# EAGLE design RS232- EIB_Router V1.0 (EAGLE 5.10)
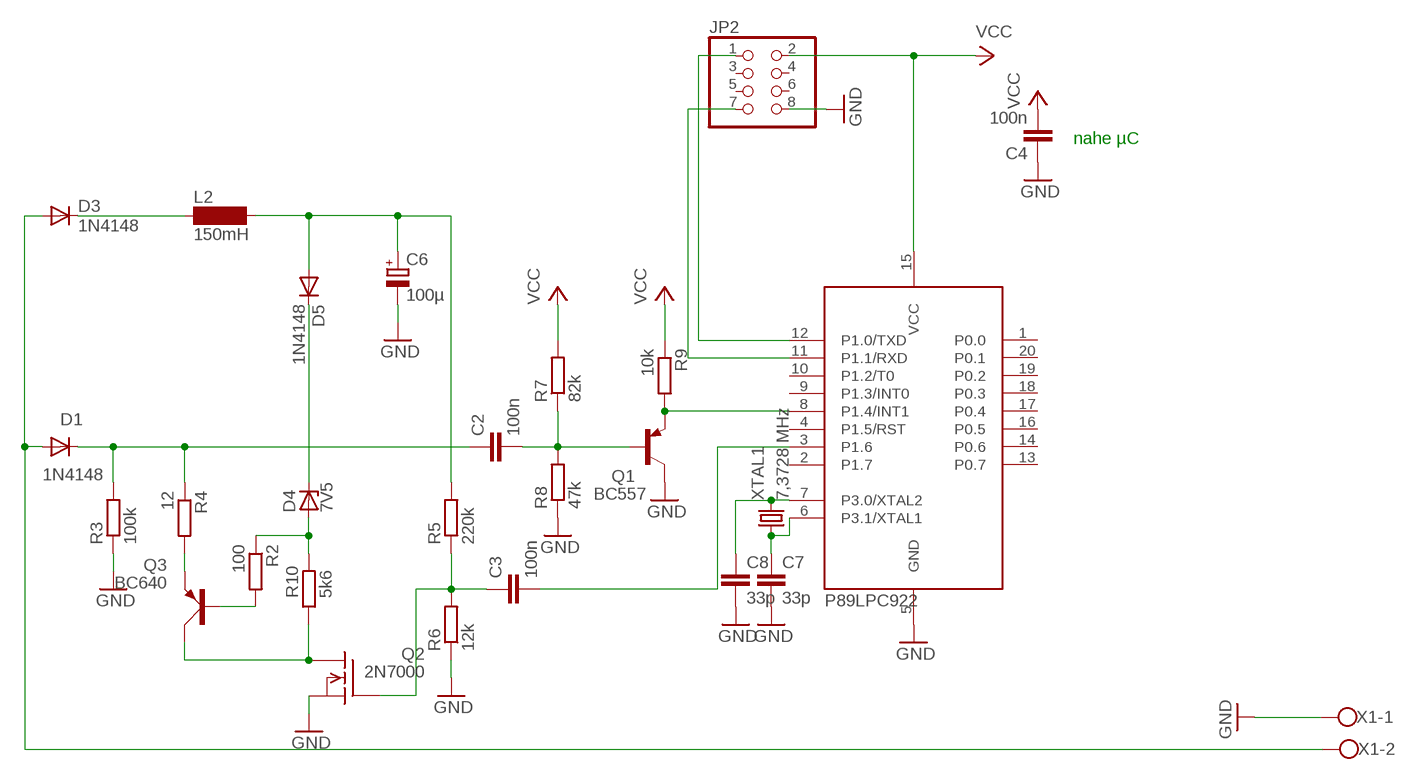
[diagram p0: schematic, sheet 1]

## Parts
C2  100n  C-EU050-024X044  [C050-024X044]
C3  100n  C-EU050-024X044  [C050-024X044]
C4  100n  C-EU050-024X044  [C050-024X044]
C6  100µ  CPOL-EUE5-8.5  [E5-8,5]
C7  33p  C-EU025-024X044  [C025-024X044]
C8  33p  C-EU025-024X044  [C025-024X044]
D1  1N4148  1N4148DO35-7  [DO35-7]
D3  1N4148  1N4148DO35-7  [DO35-7]
D4  7V5  ZPD  [DO35Z10]
D5  1N4148  1N4148DO35-7  [DO35-7]
JP2  PINHD-2X4  [2X04]
L2  150mH  SD12-1000  [SD12_1000]
Q1  BC557  [TO92]
Q2  2N7000  VN2222KM  [TO237]
Q3  BC640  [SOT54D]
R2  100  R-EU_0207/10  [0207/10]
R3  100k  R-EU_0207/10  [0207/10]
R4  12  R-EU_0207/10  [0207/10]
R5  220k  R-EU_0207/10  [0207/10]
R6  12k  R-EU_0207/10  [0207/10]
R7  82k  R-EU_0207/10  [0207/10]
R8  47k  R-EU_0207/10  [0207/10]
R9  10k  R-EU_0207/10  [0207/10]
R10  5k6  R-EU_0207/10  [0207/10]
U1  89LPC922  [DIL20]
X1  W237-102  [W237-102]
XTAL1  7,3728 MHz  CRYSTALHC49S  [HC49/S]

## Nets
GND: C4.1 C6.- C7.2 C8.2 JP2.8 Q1.3(C) Q2.3(S) R3.1 R6.1 R8.1 U1.5(GND) X1.1
N$1: Q1.1(E) R9.2 U1.8(P1.4/INT1)
N$2: C2.2 Q1.2(B) R7.1 R8.2
N$3: C6.+ D5.A L2.2 R5.2
N$5: C3.2 U1.3(P1.6)
N$6: Q2.1(D) Q3.C R10.1
N$8: D3.C L2.1
N$9: C2.1 D1.C R3.2 R4.1
N$11: D4.A R2.1 R10.2
N$12: Q3.E R4.2
N$14: Q3.B R2.2
N$16: D1.A D3.A X1.2
N$20: C8.1 U1.7(P3.0/XTAL2) XTAL1.2
N$21: C7.1 U1.6(P3.1/XTAL1) XTAL1.1
N$29: JP2.1 U1.12(P1.0/TXD)
N$30: JP2.7 U1.11(P1.1/RXD)
N$34: C3.1 Q2.2(G) R5.1 R6.2
N$40: D4.C D5.C
VCC: C4.2 JP2.2 R7.2 R9.1 U1.15(VCC)
Unconnected: JP2.3 JP2.4 JP2.5 JP2.6 U1.1(P0.0) U1.2(P1.7) U1.4(P1.5/RST) U1.9(P1.3/INT0) U1.10(P1.2/T0) U1.13(P0.7) U1.14(P0.6) U1.16(P0.5) U1.17(P0.4) U1.18(P0.3) U1.19(P0.2) U1.20(P0.1)

## Notes on the sheet
- nahe µC
- P89LPC922

## Library data of the parts
C2-C4 C7 C8 = rcl:C-EU: CAPACITOR, European symbol
C6 = rcl:CPOL-EU: POLARIZED CAPACITOR, European symbol
D1 D3 D5 = diode:1N4148: DIODE high speed (Philips)
D4 = diode:ZPD: Z DIODE 500 mW
JP2 = pinhead:PINHD-2X4: PIN HEADER
L2 = inductor-neosid:SD12: INDUCTOR nominal inductance
Q1 = transistor-pnp:BC557: PNP Transistor
Q2 = transistor-fet:VN2222KM: N-Channel Enhancement MOSFET (VMOS); 60V; 0,5A; 7,5Ohm
Q3 = transistor-small-signal:BC640: PNP TRANSISTOR
R2-R10 = rcl:R-EU_: RESISTOR, European symbol
U1 = micro-philips:89LPC922
X1 = con-wago-500:W237-102: WAGO SCREW CLAMP
XTAL1 = crystal:CRYSTAL: CRYSTAL

## Board
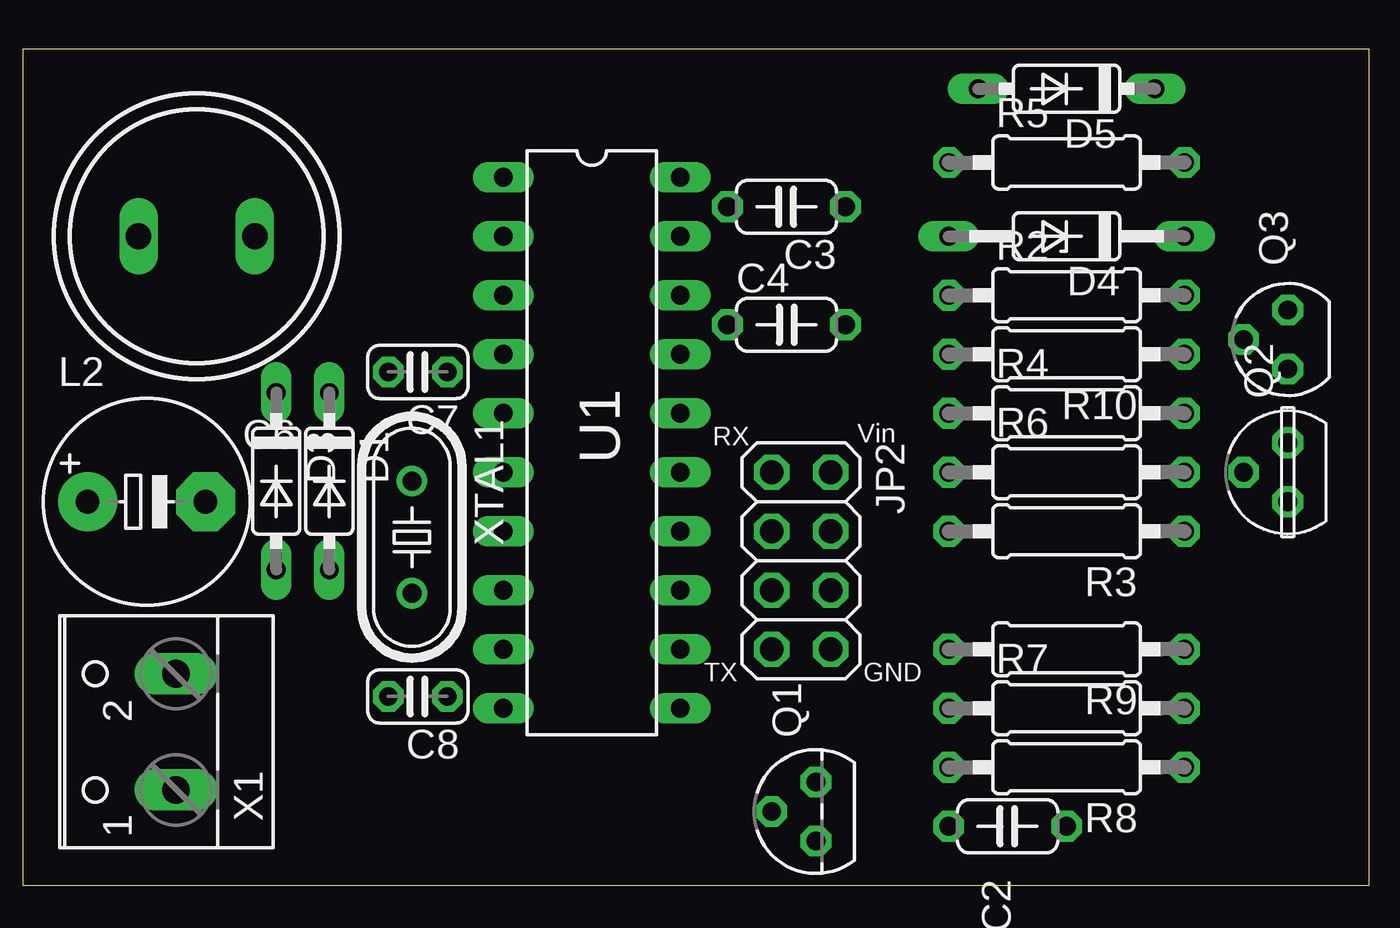
[diagram p1: board, top side]
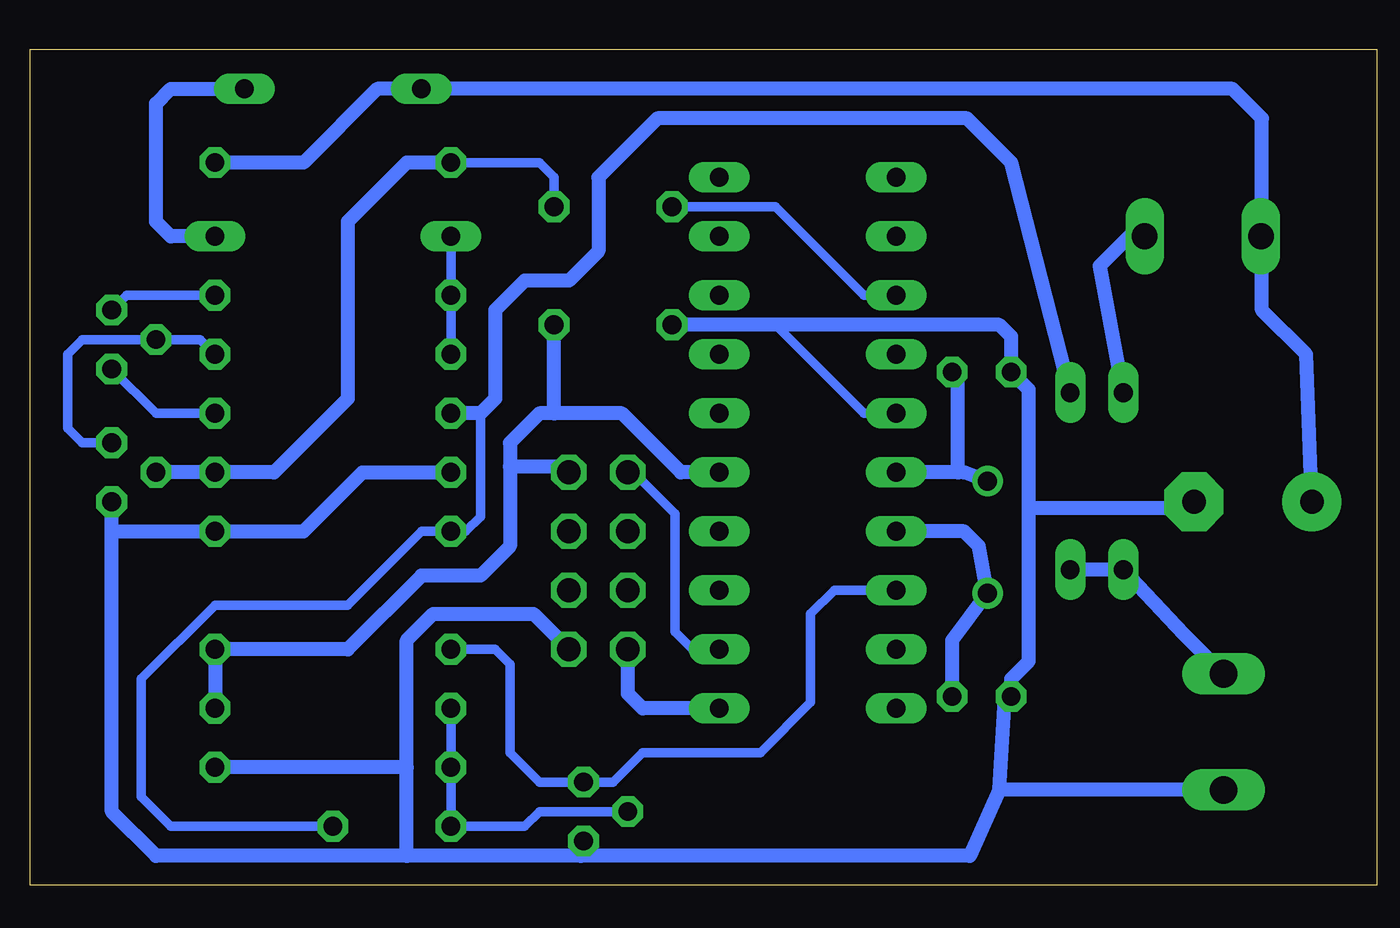
[diagram p2: board, bottom side, seen from below]

No outline drawn. Coordinates in mm, seen from the top.
Copper layers (1*16): Top 0.035mm / dielectric 1.5mm / Bottom 0.035mm
Design rules "0.3mm": minimum track width 10mil, minimum drill 24mil, track to track 0.3mm, track to pad 0.3mm, pad to pad 0.3mm, via to via 0.3mm, smd to smd 0.3mm, copper to edge 0mil, drill to drill 8mil, minimum pad ring 10mil, minimum via ring 8mil, stop-mask expansion 4mil, vias tented up to drill 0mil, thermal gap 10mil
Milling: 4 lines

### Footprints (pad centres in the part's own frame; a part is rotated, then mirrored left to right if it is on the bottom)
C050-024X044 = drill 0.813 octagon: 1 -2.54,0; 2 2.54,0
E5-8,5 = drill 1.016 pad 2.54 round: + -2.54,0 | drill 1.016 pad 2.54 octagon: - 2.54,0
C025-024X044 = drill 0.813 octagon: 1 -1.27,0; 2 1.27,0
DO35-7 = drill 0.813 long: A 3.81,0; C -3.81,0
DO35Z10 = drill 0.813 long: A 5.08,0; C -5.08,0
2X04 = drill 1.016 octagon: 1 -3.81,-1.27; 2 -3.81,1.27; 3 -1.27,-1.27; 4 -1.27,1.27; 5 1.27,-1.27; 6 1.27,1.27; 7 3.81,-1.27; 8 3.81,1.27
SD12_1000 = drill 1.1 long: 1 -2.5,0; 2 2.5,0
TO92 = drill 0.813 octagon: 1 1.27,0; 2 0,1.905; 3 -1.27,0
TO237 = drill 0.813 octagon: 1 1.27,0; 2 0,1.905; 3 -1.27,0
SOT54D = drill 0.813 octagon: B 1.27,0; C 0,1.905; E -1.27,0
0207/10 = drill 0.813 octagon: 1 -5.08,0; 2 5.08,0
DIL20 = drill 0.813 long: 1 -11.43,-3.81; 2 -8.89,-3.81; 3 -6.35,-3.81; 4 -3.81,-3.81; 5 -1.27,-3.81; 6 1.27,-3.81; 7 3.81,-3.81; 8 6.35,-3.81; 9 8.89,-3.81; 10 11.43,-3.81; 11 11.43,3.81; 12 8.89,3.81; 13 6.35,3.81; 14 3.81,3.81; 15 1.27,3.81; 16 -1.27,3.81; 17 -3.81,3.81; 18 -6.35,3.81; 19 -8.89,3.81; 20 -11.43,3.81
W237-102 = drill 1.194 long: 1 -2.5,-1.27; 2 2.5,-1.27
HC49/S = drill 0.813 round: 1 -2.413,0; 2 2.413,0

### Placement (x,y rotation side)
C2  42.42,2.54 180 top
C3  32.89,29.21 180 top
C4  32.89,24.13 0 top
C6  5.33,16.51 0 top
C7  17.02,22.1 180 top
C8  17.02,8.13 180 top
D1  13.21,17.4 270 top
D3  10.92,17.4 270 top
D4  44.96,27.94 180 top
D5  44.96,34.29 180 top
JP2  33.53,13.97 270 top
L2  7.49,27.94 180 top
Q1  34.16,3.17 90 top
Q2  54.48,17.78 90 top
Q3  54.48,23.5 90 top
R2  44.96,25.4 0 top
R3  44.96,15.24 180 top
R4  44.96,20.32 0 top
R5  44.96,31.11 0 top
R6  44.96,17.78 0 top
R7  44.96,7.62 0 top
R8  44.96,5.08 180 top
R9  44.96,10.16 180 top
R10  44.96,22.86 180 top
U1  24.51,19.05 270 top
X1  5.33,6.6 90 top
XTAL1  16.76,14.99 270 top

### Tracks (layer width: path | path; a pad name or v marks a point on that pad's centre or on a via)
GND
  Bottom 0.406: U1.5 22.1,20.32 25.91,24.13 C4.1
  Bottom 0.61: 41.78,1.27 41.78,5.08 | 41.78,5.08 R8.1 | R6.1 43.69,17.78 46.23,15.24 R3.1 54.48,15.24 | 54.48,15.24 Q2.3 | 54.48,15.24 54.48,3.17 52.58,1.27 41.78,1.27 | X1.1 16.26,4.1 | 16.26,4.1 15.99,8.4 15.99,8.37 C8.2 15.75,8.89 14.99,9.65 14.99,16.26 | 16.26,4.1 17.53,1.27 34.29,1.27 | 34.29,1.27 41.78,1.27 | Q1.3 34.29,1.78 34.29,1.27 | JP2.8 36.32,11.68 40.64,11.68 41.78,10.54 41.78,5.08 | C4.1 16.26,24.13 15.75,23.62 C7.2 14.99,21.34 14.99,16.26 | C6.- 8.13,16.26 14.99,16.26
N$1
  Bottom 0.406: U1.8 23.37,12.7 24.38,11.68 24.38,7.87 26.54,5.71 31.62,5.71 32.89,4.45 Q1.1 36.07,4.45 37.34,5.71 37.34,9.53 37.97,10.16 R9.2
N$2
  Bottom 0.406: Q1.2 36.07,3.17 36.7,2.54 C2.2 R8.2 R7.1
N$3
  Bottom 0.61: C6.+ 3.05,22.86 4.95,24.77 4.95,27.94 | R5.2 46.23,31.11 43.05,34.29 D5.A 6.22,34.29 4.95,33.02 4.95,27.94 | 4.95,27.94 L2.2
N$5
  Bottom 0.406: U1.3 22.1,25.4 25.91,29.21 C3.2
N$6
  Bottom 0.406: R10.1 50.67,23.5 Q3.C 55.75,23.5 56.39,22.86 56.39,19.68 55.75,19.05 Q2.1
N$8
  Bottom 0.61: D3.C 11.94,26.67 10.67,27.94 L2.1
N$9
  Bottom 0.406: C2.1 51.94,2.54 53.21,3.81 53.21,8.89 50.04,12.06 44.32,12.06 41.15,15.24 R3.2 39.24,15.24 38.61,15.88 38.61,20.32
  Bottom 0.61: D1.C 15.75,31.11 17.65,33.02 30.99,33.02 33.53,30.48 33.53,27.3 34.8,26.04 36.7,26.04 37.97,24.77 37.97,20.95 38.61,20.32 R4.1
N$11
  Bottom 0.406: D4.A R2.1 R10.2
N$12
  Bottom 0.406: R4.2 52.58,20.32 Q3.E
N$14
  Bottom 0.406: Q3.B 53.85,25.4 R2.2
N$16
  Bottom 0.61: D1.A D3.A 8.29,10.79 X1.2
N$20
  Bottom 0.61: U1.7 17.78,15.24 17.14,14.61 XTAL1.2 18.29,10.54 C8.1
N$21
  Bottom 0.61: 18.03,17.78 17.78,17.78 XTAL1.1 | 18.03,17.78 U1.6 | C7.1 18.03,21.84 18.03,17.78
N$29
  Bottom 0.406: U1.12 29.46,10.16 30.23,10.92 30.23,16 32,17.78 JP2.1
N$30
  Bottom 0.61: U1.11 31.62,7.62 32.26,8.26 JP2.7
N$34
  Bottom 0.406: C3.1 35.43,30.48 36.07,31.11 R5.1
  Bottom 0.61: R5.1 41.78,31.11 44.32,28.57 44.32,20.95 47.5,17.78 R6.2 Q2.2
N$40
  Bottom 0.61: D4.C 51.94,27.94 52.58,28.57 52.58,33.66 51.94,34.29 D5.C
VCC
  Bottom 0.61: R7.2 R9.1 44.32,10.16 41.15,13.34 38.61,13.34 37.34,14.61 37.34,18.03 | 37.34,18.03 37.34,19.05 36.07,20.32 35.43,20.32 | 35.43,20.32 C4.2 | 35.43,20.32 32.51,20.32 29.97,17.78 U1.15 | JP2.2 35.05,18.03 37.34,18.03

### Text on the board
tPlace: RX | Vin | TX | GND
tDocu: + | EIB | - | rs232 V1.1